# EAGLE design SLIM-DDS-107 (EAGLE 6.1)
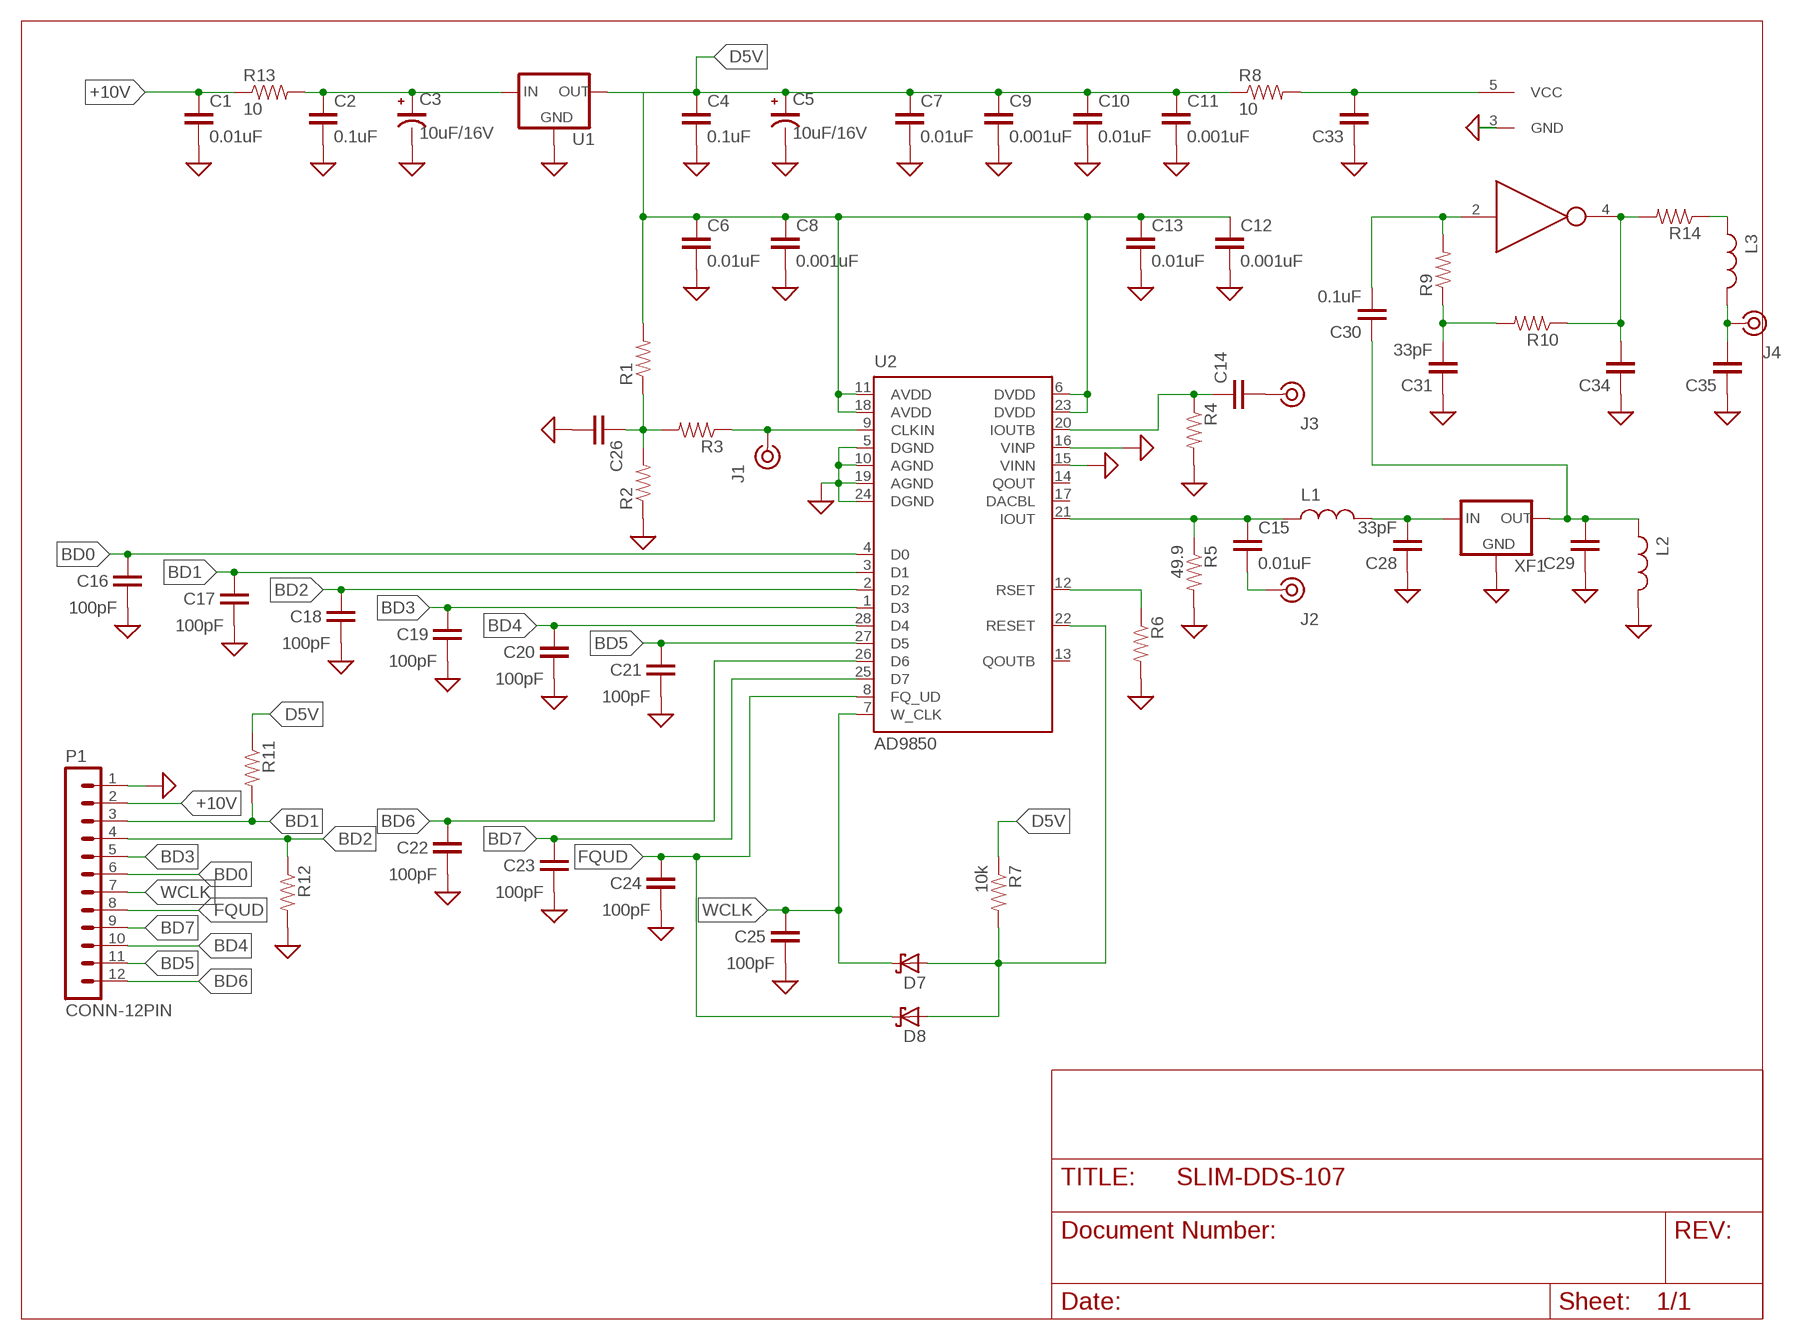
[diagram p0: schematic, sheet 1]

## Parts
C1  0.01uF  CAP0805  [0805]
C2  0.1uF  CAP0805  [0805]
C3  10uF/16V  CAP-POL1206  [EIA3216]
C4  0.1uF  CAP0805  [0805]
C5  10uF/16V  CAP-POL1206  [EIA3216]
C6  0.01uF  CAP0805  [0805]
C7  0.01uF  CAP0805  [0805]
C8  0.001uF  CAP0805  [0805]
C9  0.001uF  CAP0805  [0805]
C10  0.01uF  CAP0805  [0805]
C11  0.001uF  CAP0805  [0805]
C12  0.001uF  CAP0805  [0805]
C13  0.01uF  CAP0805  [0805]
C14  CAP0805  [0805]
C15  0.01uF  CAP0805  [0805]
C16  100pF  CAP0805  [0805]
C17  100pF  CAP0805  [0805]
C18  100pF  CAP0805  [0805]
C19  100pF  CAP0805  [0805]
C20  100pF  CAP0805  [0805]
C21  100pF  CAP0805  [0805]
C22  100pF  CAP0805  [0805]
C23  100pF  CAP0805  [0805]
C24  100pF  CAP0805  [0805]
C25  100pF  CAP0805  [0805]
C26  CAP0805  [0805]
C28  33pF  CAP0805  [0805]
C29  CAP0805  [0805]
C30  0.1uF  CAP0805  [0805]
C31  33pF  CAP0805  [0805]
C33  CAP0805  [0805]
C34  CAP0805  [0805]
C35  CAP0805  [0805]
D7  SCHOTTKY-DIODE-SOD323  [SOD323]
D8  SCHOTTKY-DIODE-SOD323  [SOD323]
J1  COAX  [SLIM_COAX_PAD]
J2  COAX  [SLIM_COAX_PAD]
J3  COAX  [SLIM_COAX_PAD]
J4  COAX  [SLIM_COAX_PAD]
L1  INDUCTOR0805  [0805-IND]
L2  INDUCTOR0805  [0805-IND]
L3  INDUCTOR0805  [0805-IND]
P1  CONN-12PIN  [CONN-12PIN]
R1  RESISTOR0805  [0805]
R2  RESISTOR0805  [0805]
R3  RESISTOR0805  [0805]
R4  RESISTOR0805  [0805]
R5  49.9  RESISTOR0805  [0805]
R6  RESISTOR0805  [0805]
R7  10k  RESISTOR0805  [0805]
R8  10  RESISTOR0805  [0805]
R9  RESISTOR0805  [0805]
R10  RESISTOR0805  [0805]
R11  RESISTOR0805  [0805]
R12  RESISTOR0805  [0805]
R13  10  RESISTOR0805  [0805]
R14  RESISTOR0805  [0805]
U1  78MXXLDPAK  [TO252]
U2  AD9850  [SSOP28]
U$1  7SZ04SOT-23  [SOT23-5L]
XF1  XTALFILTER  [XTALFILTER]

## Nets
+10V: C1.1 P1.2 R13.1
BD0: C16.2 P1.6 U2.4(D0)
BD1: C17.2 P1.3 R11.2 U2.3(D1)
BD2: C18.2 P1.4 R12.1 U2.2(D2)
BD3: C19.2 P1.5 U2.1(D3)
BD4: C20.2 P1.10 U2.28(D4)
BD5: C21.2 P1.11 U2.27(D5)
BD6: C22.2 P1.12 U2.26(D6)
BD7: C23.2 P1.9 U2.25(D7)
D5V: C4.1 C5.A(+) C6.1 C7.1 C8.1 C9.1 C10.1 C11.1 C12.1 C13.1 R1.2 R7.1 R8.1 R11.1 U1.2(OUT) U2.6(DVDD) U2.11(AVDD) U2.18(AVDD) U2.23(DVDD)
FQUD: C24.2 D8.C P1.8 U2.8(FQ_UD)
GND: C1.2 C2.2 C3.C(-) C4.2 C5.C(-) C6.2 C7.2 C8.2 C9.2 C10.2 C11.2 C12.2 C13.2 C16.1 C17.1 C18.1 C19.1 C20.1 C21.1 C22.1 C23.1 C24.1 C25.1 C26.2 C28.1 C29.1 C31.1 C33.1 C34.1 C35.1 L2.2 P1.1 R2.1 R4.2 R5.2 R6.2 R12.2 U1.3(GND) U2.5(DGND) U2.10(AGND) U2.15(VINN) U2.16(VINP) U2.19(AGND) U2.24(DGND) U$1.3(GND) XF1.3(GND)
N$2: C2.1 C3.A(+) R13.2 U1.1(IN)
N$3: C33.2 R8.2 U$1.5(VCC)
N$4: C26.1 R1.1 R2.2 R3.2
N$5: J1.P$1 R3.1 U2.9(CLKIN)
N$6: D7.A D8.A R7.2 U2.22(RESET)
N$7: C15.1 L1.1 R5.1 U2.21(IOUT)
N$8: R6.1 U2.12(RSET)
N$9: C15.2 J2.P$1
N$10: C14.1 R4.1 U2.20(IOUTB)
N$11: C34.2 R10.1 R14.2 U$1.4(OUT)
N$12: C31.2 R9.1 R10.2
N$13: L3.1 R14.1
N$14: C35.2 J4.P$1 L3.2
N$15: C28.2 L1.2 XF1.2(IN)
N$16: C29.2 C30.1 L2.1 XF1.1(OUT)
N$17: C30.2 R9.2 U$1.2(IN)
N$18: C14.2 J3.P$1
WCLK: C25.2 D7.C P1.7 U2.7(W_CLK)
Unconnected: U2.13(QOUTB) U2.14(QOUT) U2.17(DACBL)

## Power pins joined to a net without a drawn wire
GND: J1.P$2 J2.P$2 J3.P$2 J4.P$2

## Library data of the parts
C1 C2 C4 C6-C26 C28-C31 C33-C35 = SLIM:CAP: Capacitor Standard 0603 ceramic capacitor, and 0.1" leaded capacitor.
C3 C5 = SLIM:CAP-POL
D7 D8 = SLIM:SCHOTTKY-DIODE
J1-J4 = SLIM:COAX
L1-L3 = SLIM:INDUCTOR
P1 = SLIM:CONN-12PIN
R1-R14 = SLIM:RESISTOR: Resistor Basic schematic elements and footprints for 0603, 1206, and PTH resistors.
U1 = SLIM:78MXXL: VOLTAGE REGULATOR
U2 = SLIM:AD9850
U$1 = SLIM:7SZ04
XF1 = SLIM:XTALFILTER

## Board

Size 60.96 x 30.48 mm. Coordinates in mm from the lower left corner, seen from the top.
Outline: 0,0 60.96,0 60.96,30.48 0,30.48 0,0
Copper layers (1*16): Top 0.035mm / dielectric 1.5mm / Bottom 0.035mm
Design rules: minimum track width 8mil, minimum drill 20mil, track to track 8mil, track to pad 8mil, pad to pad 8mil, via to via 8mil, smd to smd 0mil, copper to edge 0mil, drill to drill 8mil, minimum pad ring 12mil, minimum via ring 10mil, stop-mask expansion 4mil, vias tented up to drill 25mil, thermal gap 10mil

### Footprints (pad centres in the part's own frame; a part is rotated, then mirrored left to right if it is on the bottom)
0805 = smd 0.8 x 1.2: 1 -0.9,0; 2 0.9,0
EIA3216 = smd 1.4 x 1.6: A 1.4,0; C -1.4,0
SOD323 = smd 0.6 x 0.7: A 1.25,0; C -1.25,0
SLIM_COAX_PAD = drill 0.508 pad 1.016: P$1 0,0 | smd 1.27 x 0.635 bottom: P$2 0,-1.397
0805-IND = smd 1 x 1.75: 1 -0.875,0; 2 0.875,0
CONN-12PIN = drill 1.016 square: 1 -13.97,0 | drill 1.016: 2 -11.43,0; 3 -8.89,0; 4 -6.35,0; 5 -3.81,0; 6 -1.27,0; 7 1.27,0; 8 3.81,0; 9 6.35,0; 10 8.89,0; 11 11.43,0; 12 13.97,0
TO252 = smd 1 x 1.6: 1 -2.28,-4.8; 2 2.28,-4.8 | smd 5.4 x 6.2: 3 0,2.5
SSOP28 = smd 0.42 x 1.34: 1 -4.16,-3.6; 2 -3.52,-3.6; 3 -2.88,-3.6; 4 -2.24,-3.6; 5 -1.6,-3.6; 6 -0.96,-3.6; 7 -0.32,-3.6; 8 0.32,-3.6; 9 0.96,-3.6; 10 1.6,-3.6; 11 2.24,-3.6; 12 2.88,-3.6; 13 3.52,-3.6; 14 4.16,-3.6; 15 4.16,3.6; 16 3.52,3.6; 17 2.88,3.6; 18 2.24,3.6; 19 1.6,3.6; 20 0.96,3.6; 21 0.32,3.6; 22 -0.32,3.6; 23 -0.96,3.6; 24 -1.6,3.6; 25 -2.24,3.6; 26 -2.88,3.6; 27 -3.52,3.6; 28 -4.16,3.6
SOT23-5L = smd 0.55 x 1.2: 1 -0.95,-1.3; 2 0,-1.3; 3 0.95,-1.3; 4 0.95,1.3; 5 -0.95,1.3
XTALFILTER = smd 1 x 1.6: 1 -2.28,-4.8; 2 2.28,-4.8 | smd 10 x 10: 3 0,2

### Placement (x,y rotation side)
C1  13,24 90 top
C2  6.5,19 0 top
C3  8,22.73 90 top
C4  29.5,5 0 top
C5  3.5,9.5 0 top
C6  34,7.25 270 top
C7  19.5,7 270 top
C8  35.5,7.25 270 top
C9  21,7 270 top
C10  37.5,14 90 top
C11  36,14 90 top
C12  20.5,13.5 90 top
C13  19,13.5 90 top
C14  39.75,8.75 270 top
C15  48.73,4 0 top
C16  23,24 270 top
C17  15.5,24 270 top
C18  18.5,24 270 top
C19  20.5,24 270 top
C20  33.5,24 270 top
C21  36,24 270 top
C22  38.5,24 270 top
C23  31,24 270 top
C24  29.5,24 270 top
C25  24.5,24 270 top
C26  18,7 270 top
C28  48.73,6 180 top
C29  46.73,17.5 180 top
C30  46.73,23 0 top
C31  50.98,24.75 0 top
C33  45.46,27.63 270 top
C34  50.23,27 90 top
C35  57.73,24.5 180 top
D7  26,24 90 top
D8  28,24 90 top
J1  21.5,10.16 0 top
J2  54.36,6.35 0 top
J3  39.84,5.96 0 top
J4  54.36,23.63 0 top
L1  46.23,5 90 top
L2  46.73,19.5 0 top
L3  57.23,27 270 top
P1  24.5,21 0 top
R1  14.66,9.62 90 top
R2  16.5,7 90 top
R3  19,10.25 180 top
R4  37.25,9.25 270 top
R5  41.5,12.5 90 top
R6  24.5,5 180 top
R7  39,14 90 top
R8  38,28 0 top
R9  49.48,23 180 top
R10  51.73,27 270 top
R11  17,17 90 top
R12  17,24 90 top
R13  11,24 90 top
R14  54.23,28 180 top
U1  9,14.5 270 top
U2  28.5,11.5 270 top
U$1  47.88,26.67 0 top
XF1  51.07,12.7 270 top

### Tracks (layer width: path | path; a pad name or v marks a point on that pad's centre or on a via)
+10V
  Top 0.762: R13.1 C1.1 arc-90 13.07,23.03 P1.2
BD0
  Top 0.381: U2.4 25.74,13.74 26.5,14.5 26.5,17 P1.6 C16.2
BD1  (1 unrouted)
  Top 0.381: U2.3 23.62,14.38 17,18 | R11.2 P1.3 arc-90 15.5,21.11 C17.2
BD2
  Top 0.381: U2.2 24,15 P1.4 | R12.1 P1.4 | C18.2 P1.4
BD3
  Top 0.381: U2.1 P1.5 C19.2
BD4
  Top 0.381: U2.28 P1.10 C20.2
BD5
  Top 0.381: U2.27 33,15 P1.11 C21.2
BD6
  Top 0.381: U2.26 33.38,14.38 arc90 33.5,14.5 P1.12 C22.2
BD7
  Top 0.381: U2.25 31.26,13.74 30.5,14.5 30.5,17 P1.9 C23.2
D5V  (1 unrouted)
  Top 0.343: U2.23 arc71 28.5,10 | 33.6,8.65 33,9.25
  Top 0.356: U2.11 23.76,9.26 21.9,7.9 | 34,12.5 33.96,12.46 U2.23 | C6.1 33.6,8.65 | 33,9.25 U2.18
  Top 0.381: 34,12.5 C11.1 C10.1 R7.1 | 17,12.5 17,16 | U2.6 20.64,12.46 C12.1 | C9.1 21.9,7.9 | U2.11 28.24,9.26 | 28.24,9.26 28.5,9 | U2.18 28.24,9.26
  Top 0.508: C6.1 C8.1
  Top 0.762: 4.2,10.2 U1.2 4.2,12.8 2.25,16.5 2.25,26.5 4,28 R8.1 | 4.2,9 C5.A | 4.2,10.2 arc-90 4.5,10.5 4.52,10.52 R1.2 15.02,10.52 17,12.5 19.5,12.5 | 4.2,10.2 4.2,9 | C13.1 19.4,12.6 19.5,12.5 | 19.5,12.5 20.4,12.5 C12.1 | C7.1 C9.1 | 28.5,10 28.5,9 28.5,5.1 C4.1 28.5,5 28.5,4 27.5,3 7,3 4.24,6 4.2,6.04 4.2,9
FQUD
  Top 0.381: U2.8 28.18,11.18 29,12 29,17 P1.8 | P1.8 D8.C | C24.2 P1.8
GND  (via drill 0.51)  (1 unrouted)
  Top 0.356: 33.35,13.1 v33.75,13.5 | v23.25,13.5 23.75,13.11 | U2.19 30.85,9.9 arc-90 v30.5,10.25 | 48.83,24.67 v49,24.5 49.25,24.75 C31.1
  Top 0.381: C16.1 v21.75,25 | C11.2 C10.2 | v23.25,10 23.25,9.9 U2.10 26.5,9.9 v26.5,10.25 | 23.75,13.11 U2.5 | U2.5 v26.75,13.11 | U2.5 | U2.24 33.25,13.11 v33.75,13.5 35.15,14.9 C11.2 | U2.24 v30.25,13.11 | U2.24 | C11.2 36,15 | v34,9.5 33.6,9.9 32.2,9.9 | U$1.3 49,25.2 49,25 | U2.16 U2.15
  Top 0.762: P1.1 10.2,21.33 C3.C | C1.2 C17.1 | C25.1 C16.1 C19.1 C18.1 R12.2 C17.1 | C24.1 C23.1 C20.1 | C20.1 34.75,24.9 | C20.1 32.6,24.9 | 34.75,24.9 C21.1 C22.1 37.25,24.9 v37.25,25 | v14.25,25 14.25,24.9 C17.1 | v32.25,25 32.25,24.9 C20.1 | 34.75,24.9 v34.75,25 | U1.3 9.5,14.5 10.5,17.5 | C13.2 C12.2 | C31.1 50.08,25.95 C34.1 | C28.1 v50.23,6
  Top 1.016: R5.2 v41.5,14.5
  other vias: 37.25,7.25 34.75,5.5 19,15.5 48.9,12.7 22.25,6 18.75,5 15.25,6 60.33,29.84 60.33,15.24 60.33,19.05 53.34,29.84 57.15,29.84 49.53,29.84 45.72,29.84 41.91,29.84 38.1,29.84 34.29,29.84 30.48,29.84 26.67,29.84 22.86,29.84 19.05,29.84 15.24,29.84 11.43,29.84 7.62,29.84 3.81,29.84 0.64,29.84 0.64,15.24 0.64,19.05 0.64,22.86 0.64,26.67 0.64,7.62 0.64,11.43 0.64,0.64 0.64,3.81 7.62,0.64 3.81,0.64 15.24,0.64 11.43,0.64 22.86,0.64 19.05,0.64 26.67,0.64 34.29,0.64 30.48,0.64 41.91,0.64 38.1,0.64 49.53,0.64 45.72,0.64 53.34,0.64 57.15,0.64 60.33,0.64 60.33,3.81 60.33,7.62 60.33,11.43 60.33,22.86 60.33,26.67 37,16.75 9.5,16.5 11.5,16.5 13.5,16.5 13.5,12.5 11.5,12.5 9.5,12.5 31.5,5 43.81,7.62 43.81,11.43 43.81,15.24 43.81,19.05 43.81,22.86
  pour Top (no thermals): 11.5,22 11.5,16 8.5,16 8.5,18.5 7,18.5 7,22
  pour Bottom: 0.64,29.84 60.33,29.84 60.33,0.64 0.64,0.64
  pour Top: 47.23,20.75 49.73,20.75 49.73,17 47.23,17
  pour Top (isolate 0.508, no thermals): 0.51,29.97 60.45,29.97 60.45,0.51 0.51,0.51
N$2  (1 unrouted)
  Top 0.762: 8,24 6.5,24 5.5,23 5.5,19.1 C2.1 U1.1 | C3.A 8.77,24.9 R13.2
N$3
  Top 0.381: 45.78,26.73 U$1.5
  Top 0.508: C33.2 45.78,26.73
  Top 0.762: R8.2 41.85,28 43.18,26.67 45.4,26.67 C33.2
N$4
  Top 0.381: 18,10.15 R3.2
  Top 0.762: R1.1 R2.2 C26.1 18,10.15
N$5
  Top 0.356: 22,11 arc-44 24.25,10.5 24.9,10.5
  Top 0.381: 21.41,10.25 J1.P$1 21.5,10.5 arc-90 22,11 | 24.9,10.5 U2.9
  Top 0.762: R3.1 21.41,10.25
N$6
  Top 0.381: D7.A D8.A 27,25.25 27,26.5 39,26.5 40,25.5 40,20 R7.2 39.6,14.9 40.25,14 40.25,12.5 39.82,11.82 U2.22
N$7
  Top 0.381: U2.21 41.08,11.18 R5.1
  Top 0.508: 41.08,11.18 41.82,11.18 42,11 42,4.5 42.5,4 46.1,4 L1.1 47.7,4.12 C15.1
N$8
  Top 0.381: U2.12 25.88,8.62 26.25,8.25 26.25,5.85 R6.1
N$9
  Top 0.762: C15.2 52.73,4 J2.P$1
N$10
  Top 0.381: U2.20 37.25,10.54 | 37.25,10.54 38.75,10.54 C14.1 | R4.1 37.25,10.54
N$11
  Top 0.762: R14.2 53.23,27.9 R10.1 C34.2 48.9,27.9 U$1.4
N$12
  Top 0.762: R10.2 51.88,25.95 C31.2 51.88,24.5 R9.1
N$13
  Top 0.762: R14.1 57.1,28 L3.1
N$14
  Top 0.762: L3.2 56.83,25.73 C35.2
  Top 1.016: J4.P$1 54.73,23.63 L3.2
N$15
  Top 0.508: L1.2 47.7,5.88 C28.2
  Top 1.016: L1.2 46.23,10.38 XF1.2
N$16
  Top 0.762: XF1.1 46.25,14.98 arc-90 46.23,15 arc-90 45.83,15.4 C29.2 45.83,19.48 arc-90 L2.1 arc-90 45.83,19.52 C30.1
N$17  (1 unrouted)
  Top 0.381: U$1.2 47.88,23 47.73,23
  Top 0.762: 47.73,23 R9.2
N$18
  Top 0.381: C14.2 39.84,7.76 J3.P$1
WCLK
  Top 0.381: U2.7 27.32,11.82 28,12.5 28,17 P1.7 | P1.7 D7.C | C25.2 P1.7